# EAGLE design balun (EAGLE 7.2.0)
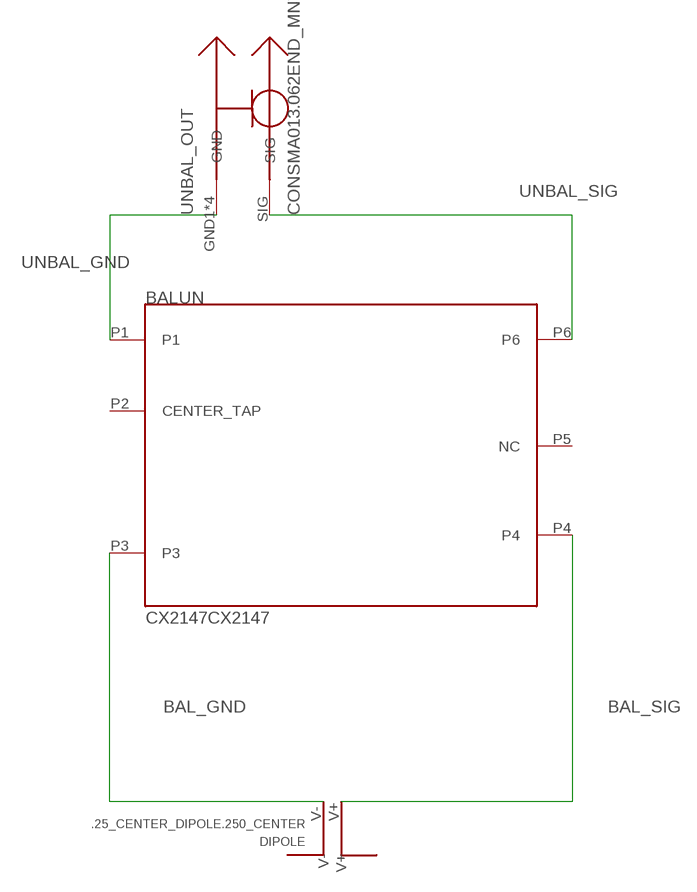
[diagram p0: schematic, sheet 1]

## Parts
BALUN  CX2147CX2147  [6-SMD]
DIPOLE  .25_CENTER_DIPOLE.250_CENTER  [.25_SPACING]
UNBAL_OUT  CONSMA013.062END_MNT  [SMA_EDGE_MNT]

## Nets
BAL_GND: BALUN.P3 DIPOLE.V-
BAL_SIG: BALUN.P4 DIPOLE.V+
UNBAL_GND: BALUN.P1 UNBAL_OUT.GND1(GND) UNBAL_OUT.GND2(GND) UNBAL_OUT.GND3(GND) UNBAL_OUT.GND4(GND)
UNBAL_SIG: BALUN.P6 UNBAL_OUT.SIG
Unconnected: BALUN.P2(CENTER_TAP) BALUN.P5(NC)

## Library data of the parts
BALUN = balun:CX2147
DIPOLE = balun:.25_CENTER_DIPOLE
UNBAL_OUT = balun:CONSMA013.062

## Board
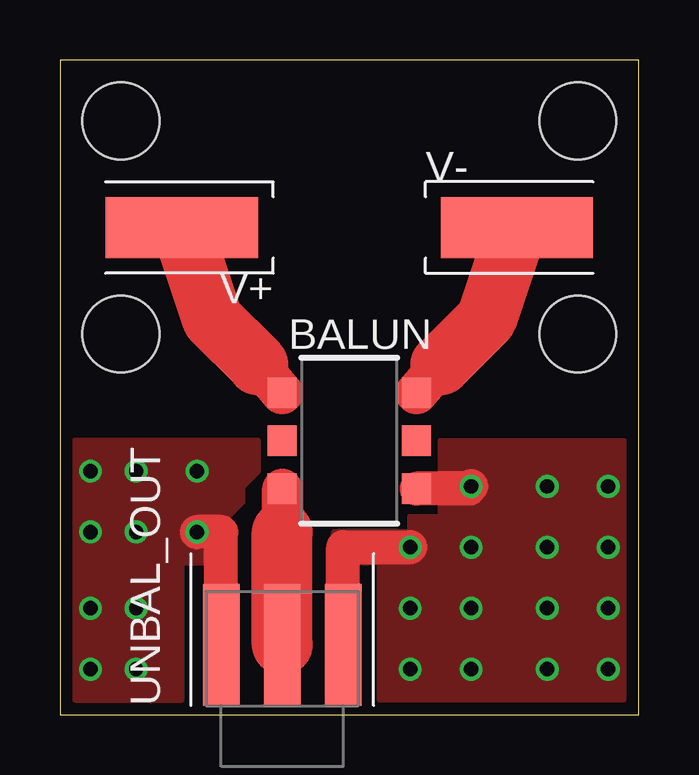
[diagram p1: board, top side]
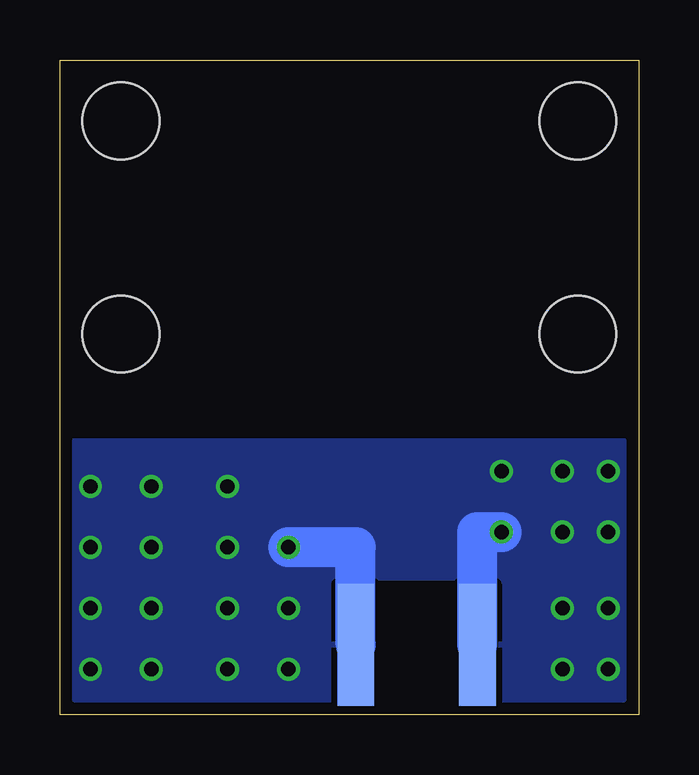
[diagram p2: board, bottom side, seen from below]

Size 24.13 x 27.3 mm. Coordinates in mm from the lower left corner, seen from the top.
Outline: 0,0 24.13,0 24.13,27.3 0,27.3 0,0
Copper layers (1*16): Top 0.0356mm / dielectric 1.5011mm / Bottom 0.0356mm
Design rules "LaenPCBOrder": minimum track width 6mil, minimum drill 13mil, track to track 6mil, track to pad 6mil, pad to pad 6mil, via to via 6mil, smd to smd 6mil, copper to edge 15mil, drill to drill 6mil, minimum pad ring 7mil, minimum via ring 7mil, stop-mask expansion 3mil, vias tented up to drill 0mil, thermal gap 10mil
Holes 3.2 mm at 2.54,24.77 2.54,15.88 21.59,15.88 21.59,24.77

### Footprints (pad centres in the part's own frame; a part is rotated, then mirrored left to right if it is on the bottom)
6-SMD = smd 1.27 x 1.206: P1 -1.994,-2.8; P2 0,-2.8; P3 1.994,-2.8; P4 1.994,2.8; P5 0,2.8; P6 -1.994,2.8
.25_SPACING = smd 6.35 x 2.54: V+ 9.525,0; V- -4.445,0
SMA_EDGE_MNT = smd 1.524 x 5.08 bottom: GND1 -2.54,0; GND2 2.54,0 | smd 1.524 x 5.08: GND3 -2.54,0; GND4 2.54,0; SIG 0,0

### Placement (x,y rotation side)
BALUN  12.06,11.43 90 top
DIPOLE  14.61,20.32 180 top
UNBAL_OUT  9.26,2.92 180 top

### Tracks (layer width: path | path; a pad name or v marks a point on that pad's centre or on a via)
BAL_GND
  Top 1.778: 15.88,14.61 BALUN.P3
  Top 2.54: DIPOLE.V- 17.78,16.51 15.88,14.61
BAL_SIG
  Top 1.778: 8.26,14.61 BALUN.P4
  Top 2.54: DIPOLE.V+ 6.35,16.51 8.26,14.61
UNBAL_GND  (via drill 0.6)
  Top 1.422: UNBAL_OUT.GND4 6.72,7.62 v5.71,7.62 | UNBAL_OUT.GND3 11.8,6.99 v14.61,6.99 | v17.14,9.53 17.06,9.44 BALUN.P1
  Bottom 1.676: UNBAL_OUT.GND4 6.72,7.62 v5.71,7.62 | UNBAL_OUT.GND3 11.8,6.99 v14.61,6.99
  other vias: 3.17,10.16 3.17,7.62 3.17,4.45 3.17,1.91 5.71,10.16 14.61,4.45 14.61,1.91 17.14,1.91 17.14,4.45 17.14,6.99 20.32,9.53 20.32,6.99 20.32,4.45 20.32,1.91 1.27,10.16 1.27,7.62 1.27,4.45 1.27,1.91 22.86,1.91 22.86,4.45 22.86,6.99 22.86,9.53
  pour Bottom: 0.64,0.64 5.71,0.64 5.71,5.71 12.7,5.71 12.7,0.64 23.5,0.64 23.5,11.43 0.64,11.43
  pour Top: 0.64,0.64 5.08,0.64 5.08,6.35 6.99,6.35 6.99,8.26 7.62,8.89 7.62,9.53 8.26,10.16 8.26,11.43 0.64,11.43
  pour Top: 13.34,0.64 13.34,6.35 11.43,6.35 11.43,7.62 14.61,7.62 14.61,8.26 15.88,8.26 15.88,11.43 23.5,11.43 23.5,0.64
UNBAL_SIG
  Top 1.676: 9.27,7.62 BALUN.P6
  Top 2.54: UNBAL_OUT.SIG 9.27,7.62